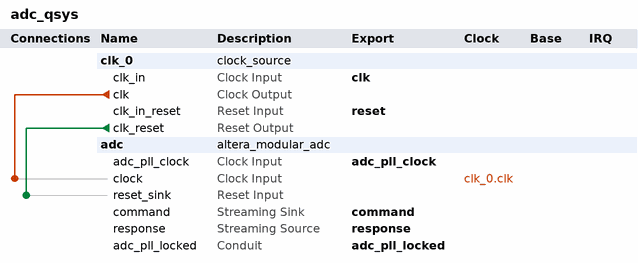
[diagram p0: system contents]
# Platform Designer (Qsys) system adc_qsys, MAX 10 10M50DAF484C7G
# Parameters at their usual value, and those the tool derives, are not listed.
package require -exact qsys 17.1
create_system adc_qsys
set_project_property DEVICE_FAMILY {MAX 10}
set_project_property DEVICE 10M50DAF484C7G

add_instance clk_0 clock_source 17.1
set_instance_parameter_value clk_0 clockFrequency 50000000

add_instance adc altera_modular_adc 17.1
set_instance_parameter_value adc CLOCK_FREQ 50000000
set_instance_parameter_value adc CORE_VAR 3
set_instance_parameter_value adc DEVICE_PART 10M50DAF484C7G
set_instance_parameter_value adc clkdiv 2
set_instance_parameter_value adc int_vref_vr 3.0
set_instance_parameter_value adc refsel 0
set_instance_parameter_value adc sample_rate 0
set_instance_parameter_value adc seq_order_length 1
set_instance_parameter_value adc seq_order_slot_1 30
set_instance_parameter_value adc seq_order_slot_2 30
set_instance_parameter_value adc seq_order_slot_3 30
set_instance_parameter_value adc seq_order_slot_4 30
set_instance_parameter_value adc seq_order_slot_5 30
set_instance_parameter_value adc seq_order_slot_6 30
set_instance_parameter_value adc seq_order_slot_7 30
set_instance_parameter_value adc use_ch0 false
set_instance_parameter_value adc use_ch2 false
set_instance_parameter_value adc use_ch3 false
set_instance_parameter_value adc use_ch4 false
set_instance_parameter_value adc use_ch5 false
set_instance_parameter_value adc use_ch6 false
set_instance_parameter_value adc use_ch7 false
set_instance_parameter_value adc use_ch8 false
set_instance_parameter_value adc use_tsd false

# connections
add_connection clk_0.clk adc.clock clock
add_connection clk_0.clk_reset adc.reset_sink reset

# exported interfaces
add_interface adc_pll_clock clock sink
set_interface_property adc_pll_clock EXPORT_OF adc.adc_pll_clock
add_interface adc_pll_locked conduit end
set_interface_property adc_pll_locked EXPORT_OF adc.adc_pll_locked
add_interface clk clock sink
set_interface_property clk EXPORT_OF clk_0.clk_in
add_interface command avalon_streaming sink
set_interface_property command EXPORT_OF adc.command
add_interface reset reset sink
set_interface_property reset EXPORT_OF clk_0.clk_in_reset
add_interface response avalon_streaming source
set_interface_property response EXPORT_OF adc.response

set_interconnect_requirement {$system} qsys_mm.clockCrossingAdapter HANDSHAKE
set_interconnect_requirement {$system} qsys_mm.enableEccProtection FALSE
set_interconnect_requirement {$system} qsys_mm.insertDefaultSlave FALSE
set_interconnect_requirement {$system} qsys_mm.maxAdditionalLatency 1

save_system adc_qsys.qsys
